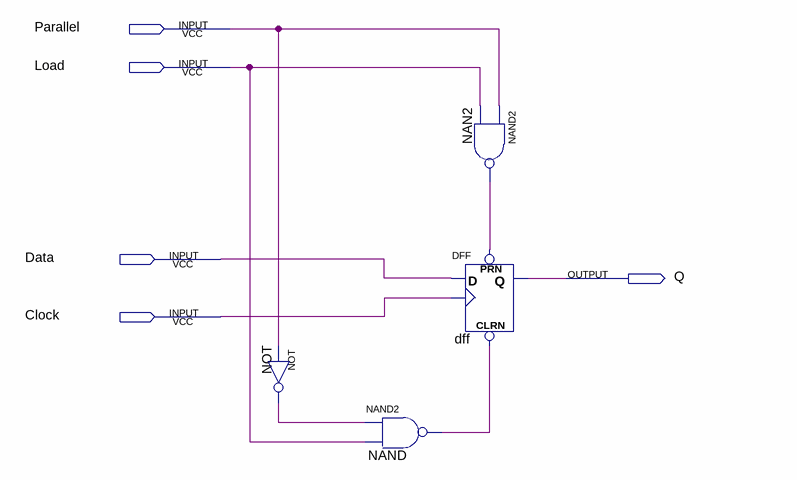
[diagram p0: schematic sheet]
// Quartus schematic register_1bit.bdf as structural Verilog: 4 symbols, 5 pins
module register_1bit (
  input  Parallel,
  input  Load,
  input  Data,
  input  Clock,
  output Q
);

  wire NAN2_out, NAND_out, NOT_out;

  not NOT (NOT_out, Parallel);
  nand NAND (NAND_out, NOT_out, Load);
  nand NAN2 (NAN2_out, Parallel, Load);
  DFF dff (.CLRN(NAND_out), .CLK(Clock), .D(Data), .PRN(NAN2_out), .Q(Q));
endmodule
